# EAGLE board eTapper1main52 (EAGLE 8.6.1)
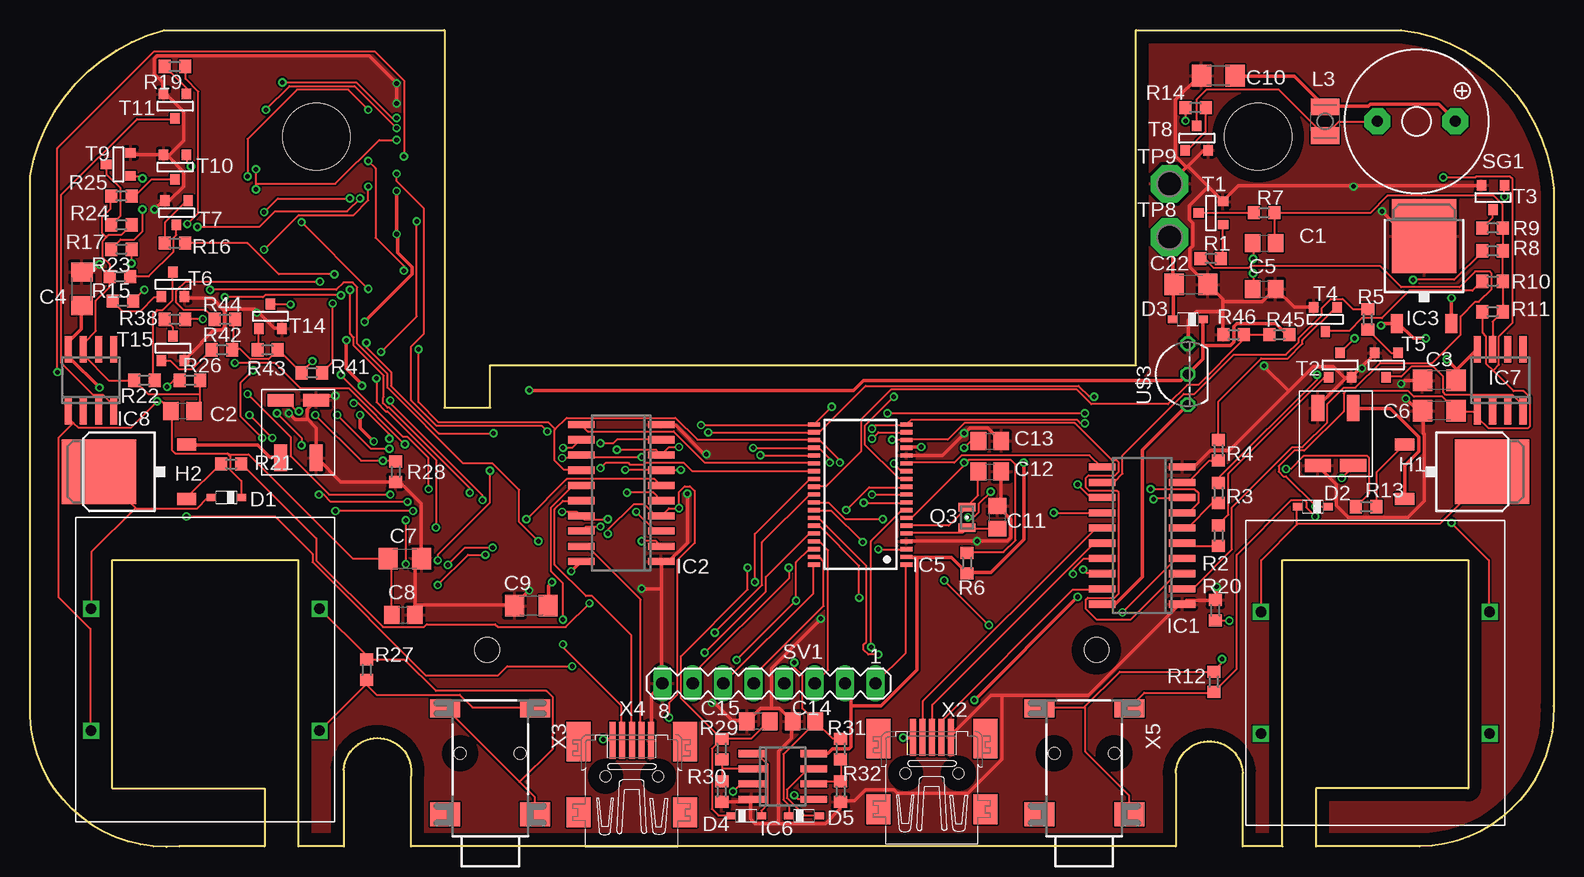
[diagram p1: board, top side]
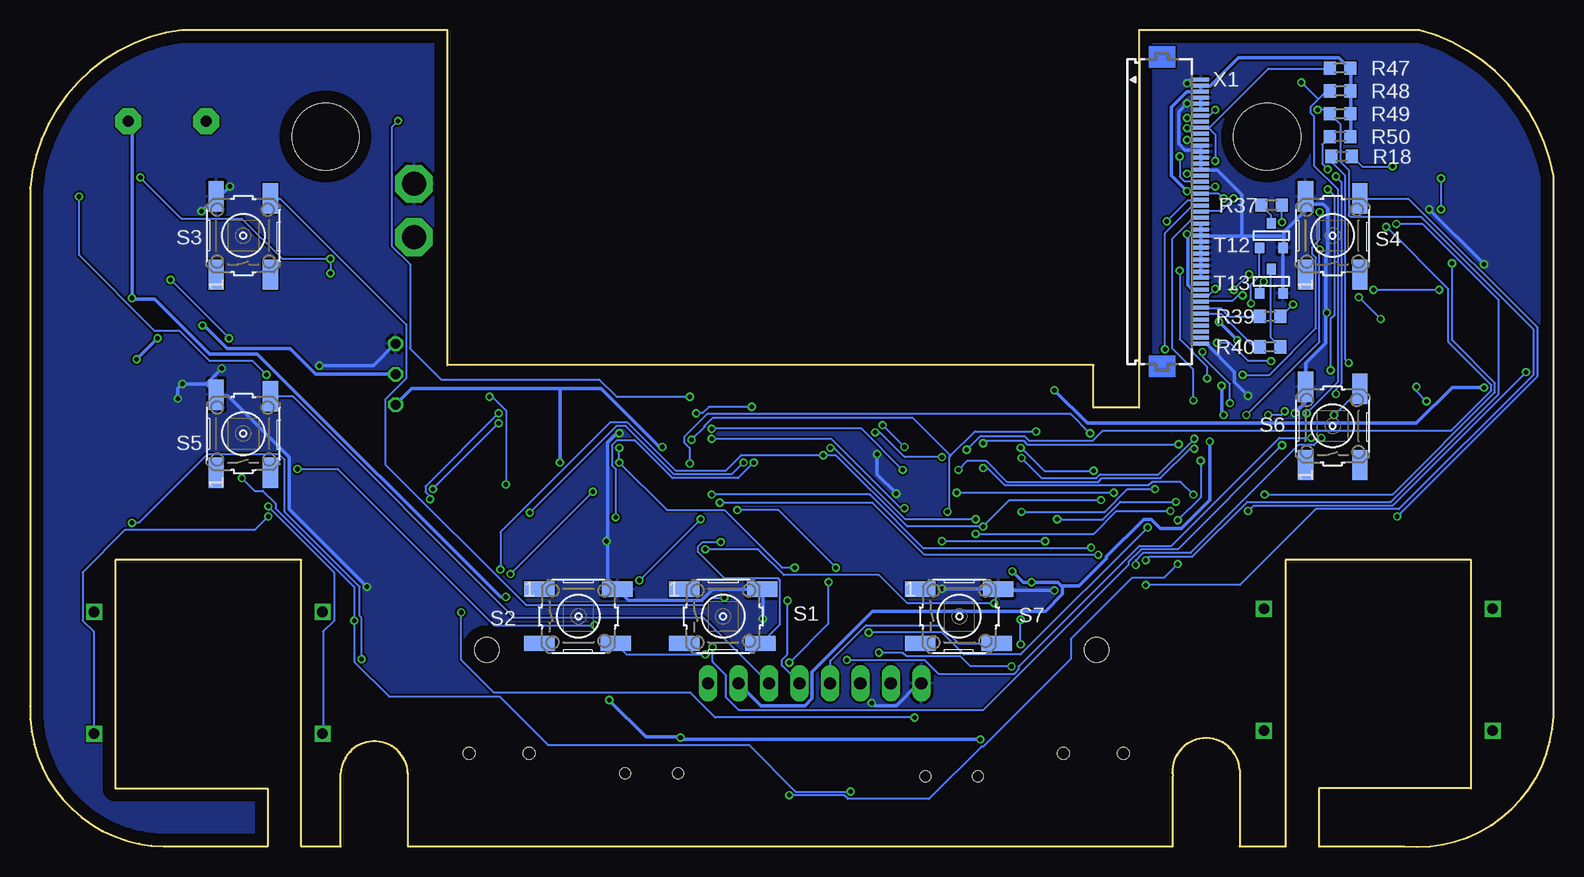
[diagram p2: board, bottom side, seen from below]

Size 127 x 68.12 mm. Coordinates in mm from the lower left corner, seen from the top.
Outline: 104.4,23.93 119.89,23.93 119.89,4.88 107.19,4.88 107.19,0.05 115.83,0.05 arc91 127,11.73 127,54.91 arc78 114.3,68.12 92.21,68.12 92.21,40.18 38.36,40.18 38.36,36.63 34.55,36.63 34.55,68.12 11.18,68.12 arc65 0,55.93 0,11.99 arc98 12.45,0.05 19.56,0.05 19.56,4.88 6.86,4.88 6.86,23.93 22.36,23.93 22.36,0.05 26.17,0.05 26.17,6.4 arc-185 31.75,5.89 31.75,0.05 95.51,0.05 95.51,6.15 arc-175 101.1,6.15 101.1,0.05 104.4,0.05 104.4,23.93
Copper layers (1*16): Top 0.035mm / dielectric 30mil / Bottom 0.035mm
Design rules "default *": minimum track width 6mil, minimum drill 15mil, track to track 6mil, track to pad 6mil, pad to pad 6mil, via to via 6mil, smd to smd 6mil, copper to edge 40mil, drill to drill 6mil, minimum pad ring 6mil, minimum via ring 6mil, stop-mask expansion 4mil, vias tented up to drill 0mil, thermal gap 10mil
Net classes: 1 GND: width 0.305 mm, clearance 0.152 mm; 2 BAT+: width 0.305 mm, clearance 0.152 mm; 3 +9V: width 0.305 mm, clearance 0.152 mm; 4 +3V: width 0.305 mm, clearance 0.152 mm; 5 VCC: width 0.305 mm, clearance 0.152 mm
Holes 5.59 mm at 23.88,59.23 102.37,59.23
Holes 2.03 mm at 38.1,16.43 88.9,16.43

## Footprints (pad centres in the part's own frame; a part is rotated, then mirrored left to right if it is on the bottom)
C0805 = smd 1.3 x 1.5: 1 -0.95,0; 2 0.95,0
C1206 = smd 1.6 x 1.8: 1 -1.4,0; 2 1.4,0
SOD323_ST = smd 0.8 x 0.6: A 1.25,0; C -1.25,0
XFMR = drill 0.889 square: P$1 -10.16,5.08; P$2 -10.16,-5.08; P$3 8.89,5.08; P$4 8.89,-5.08
D-PAK_TO252AA = smd 1 x 1.6: 1 -2.28,-4.8; 3 2.28,-4.8 | smd 5.4 x 6.2: 4 0,2.5
SO20 = smd 0.6 x 2.2: 1 -5.715,-3.33; 2 -4.445,-3.33; 3 -3.175,-3.33; 4 -1.905,-3.33; 5 -0.635,-3.33; 6 0.635,-3.33; 7 1.905,-3.33; 8 3.175,-3.33; 9 4.445,-3.33; 10 5.715,-3.33; 11 5.715,3.33; 12 4.445,3.33; 13 3.175,3.33; 14 1.905,3.33; 15 0.635,3.33; 16 -0.635,3.33; 17 -1.905,3.33; 18 -3.175,3.33; 19 -4.445,3.33; 20 -5.715,3.33
TO252 = smd 1 x 1.6: 1 -2.28,-4.8; 3 2.28,-4.8 | smd 5.4 x 6.2: 2 0,2.5
TSSOP38_R-PDSO-G38-DA = smd 0.35 x 1: 1 -5.85,-3.85; 2 -5.2,-3.85; 3 -4.55,-3.85; 4 -3.9,-3.85; 5 -3.25,-3.85; 6 -2.6,-3.85; 7 -1.95,-3.85; 8 -1.3,-3.85; 9 -0.65,-3.85; 10 0,-3.85; 11 0.65,-3.85; 12 1.3,-3.85; 13 1.95,-3.85; 14 2.6,-3.85; 15 3.25,-3.85; 16 3.9,-3.85; 17 4.55,-3.85; 18 5.2,-3.85; 19 5.85,-3.85; 20 5.85,3.85; 21 5.2,3.85; 22 4.55,3.85; 23 3.9,3.85; 24 3.25,3.85; 25 2.6,3.85; 26 1.95,3.85; 27 1.3,3.85; 28 0.65,3.85; 29 0,3.85; 30 -0.65,3.85; 31 -1.3,3.85; 32 -1.95,3.85; 33 -2.6,3.85; 34 -3.25,3.85; 35 -3.9,3.85; 36 -4.55,3.85; 37 -5.2,3.85; 38 -5.85,3.85
SO8 = smd 0.6 x 2.2: 1 -1.905,-2.6; 2 -0.635,-2.6; 3 0.635,-2.6; 4 1.905,-2.6; 5 1.905,2.6; 6 0.635,2.6; 7 -0.635,2.6; 8 -1.905,2.6
SO08 = smd 0.6 x 2.2: 1 -1.905,-2.6; 2 -0.635,-2.6; 3 0.635,-2.6; 4 1.905,-2.6; 5 1.905,2.6; 6 0.635,2.6; 7 -0.635,2.6; 8 -1.905,2.6
L2825P = smd 1.4 x 2.4: 1 -1.2,0; 2 1.2,0
FC-12M = smd 0.7 x 1.4: 1 -0.85,0; 2 0.85,0
R0603 = smd 1 x 1.1: 1 -0.85,0; 2 0.85,0
B3F-10XX = smd 2.54 x 1.27: 1 -3.251,2.261; 2 3.251,2.261; 3 -3.251,-2.261; 4 3.099,-2.261
F/QMBIII = drill 0.914 pad 2.159 octagon: + 3.251,0; - -3.251,0
MA08-1 = drill 1.016 long: 1 -8.89,0; 2 -6.35,0; 3 -3.81,0; 4 -1.27,0; 5 1.27,0; 6 3.81,0; 7 6.35,0; 8 8.89,0
SOT-23 = smd 0.787 x 0.889: 1 0.025,-1.016; 2 -0.94,1.016; 3 0.991,1.016
P1-20 = drill 2.007 pad 3.15 octagon: TP 0,0
CT02-250 = smd 1.067 x 2.184: P$1 -1.45,-2.4; P$2 1.5,-2.4 | smd 2.184 x 1.067: P$3 1.5,2.4; P$4 -1.45,2.4
TO92- = drill 0.813 octagon: 1 -1.27,1.27; 2 1.27,1.27; 3 3.81,1.27
FH12-45S-0.5SH = smd 0.3 x 1.3: 1 -13,3.25; 2 -12.5,3.25; 3 -12,3.25; 4 -11.5,3.25; 5 -11,3.25; 6 -10.5,3.25; 7 -10,3.25; 8 -9.5,3.25; 9 -9,3.25; 10 -8.5,3.25; 11 -8,3.25; 12 -7.5,3.25; 13 -7,3.25; 14 -6.5,3.25; 15 -6,3.25; 16 -5.5,3.25; 17 -5,3.25; 18 -4.5,3.25; 19 -4,3.25; 20 -3.5,3.25; 21 -3,3.25; 22 -2.5,3.25; 23 -2,3.25; 24 -1.5,3.25; 25 -1,3.25; 26 -0.5,3.25; 27 0,3.25; 28 0.5,3.25; 29 1,3.25; 30 1.5,3.25; 31 2,3.25; 32 2.5,3.25; 33 3,3.25; 34 3.5,3.25; 35 4,3.25; 36 4.5,3.25; 37 5,3.25; 38 5.5,3.25; 39 6,3.25; 40 6.5,3.25; 41 7,3.25; 42 7.5,3.25; 43 8,3.25; 44 8.5,3.25; 45 9,3.25
32005-201 = smd 3.1 x 0.5: 1 3,1.6; 2 3,0.8; 3 3,0; 4 3,-0.8; 5 3,-1.6 | smd 2.5 x 2: M1 -3,-4.45; M2 -3,4.45 | smd 3.3 x 2: M3 2.9,4.45; M4 2.9,-4.45 | hole 0.9: 0,2.2; 0,-2.2
1503_02 = smd 2.5 x 1.5: 1 -3.75,-10.75; 3 3.75,-10.75 | smd 2.5 x 2: 2 -3.75,-1.9; 2@2 3.75,-1.9 | hole 1: -2.5,-7; 2.5,-7

## Placement (x,y rotation side)
C1  .01uF  [C0805]  102.87,50.34 0 top
C2  .01uF  [C0805]  12.7,36.37 0 top
C3  [C1206]  117.48,38.91 180 top
C4  [C1206]  4.32,46.53 90 top
C5  3.3uF  [C0805]  102.87,46.53 0 top
C6  220uF  [C1206]  117.48,36.37 180 top
C7  220uF  [C1206]  31.25,24.05 0 top
C8  3.3uF  [C0805]  31.12,19.35 0 top
C9  47uF  [C1206]  41.79,20.12 180 top
C10  47uF  [C1206]  99.06,64.31 180 top
C11  12pF  [C0805]  80.65,27.48 90 top
C12  12pF  [C0805]  80.01,31.29 0 top
C13  1 uF  [C0805]  80.01,33.83 0 top
C14  0.1uF  [C0805]  64.52,10.46 180 top
C15  0.1uF  [C0805]  60.71,10.46 180 top
C22  220uF  [C1206]  96.78,46.91 0 top
D1  BAT60J  [SOD323_ST]  16.39,29.13 180 top
D2  BAT60J  [SOD323_ST]  106.94,28.37 180 top
D3  BAT60J  [SOD323_ST]  96.52,43.99 180 top
D4  BAT60J  [SOD323_ST]  59.69,2.59 0 top
D5  BAT60J  [SOD323_ST]  64.52,2.59 0 top
DRILEGEND  [DRILEGEND]  -4.57,-8.42 0 top  (outside the outline)
F1  XFMR  [XFMR]  112.78,14.53 0 top
F2  XFMR  [XFMR]  15.24,14.78 0 top
H1  IRLR024N  [D-PAK_TO252AA]  119.38,31.29 270 top
H2  IRLR024N  [D-PAK_TO252AA]  8.26,31.29 90 top
IC1  74AC373  [SO20]  92.71,25.96 90 top
IC2  74AC373  [SO20]  49.28,29.51 90 top
IC3  LM2936DT-5.0  [TO252]  116.21,48.44 0 top
IC5  MSP430F2232IDA  [TSSOP38_R-PDSO-G38-DA]  69.22,29.39 90 top
IC6  AD8620R  [SO8]  62.74,5.89 270 top
IC7  LP2951M  [SO08]  122.56,38.91 0 top
IC8  LP2951M  [SO08]  5.08,38.91 0 top
L3  470uH  [L2825P]  107.95,60.5 270 top
Q3  FC-12M  [FC-12M]  78.11,27.48 90 top
R1  47K  [R0603]  98.43,49.07 0 top
R2  47K  [R0603]  99.06,25.96 90 top
R3  47K  [R0603]  99.06,29.51 90 top
R4  47K  [R0603]  99.06,33.07 90 top
R5  47K  [R0603]  111.51,43.99 270 top
R6  47K  [R0603]  78.11,23.67 270 top
R7  1K  [R0603]  102.87,52.88 0 top
R8  3K  [R0603]  121.92,49.71 0 top
R9  6K  [R0603]  121.92,51.61 0 top
R10  12K  [R0603]  121.92,47.17 0 top
R11  3K  [R0603]  121.92,44.63 0 top
R12  51K  [R0603]  98.68,13.77 270 top
R13  1K  [R0603]  111.38,28.37 0 top
R14  1K  [R0603]  97.16,61.64 0 top
R15  47K  [R0603]  7.75,45.52 180 top
R16  47K  [R0603]  12.07,50.34 180 top
R17  47K  [R0603]  7.62,49.83 180 top
R18  47K  [R0603]  17.66,57.58 0 bottom
R19  47K  [R0603]  12.07,65.07 180 top
R20  47K  [R0603]  98.81,19.73 90 top
R21  1K  [R0603]  16.77,31.93 180 top
R22  1K  [R0603]  9.53,38.91 180 top
R23  3K  [R0603]  7.5,47.55 180 top
R24  6K  [R0603]  7.62,51.87 0 top
R25  12K  [R0603]  7.62,54.28 180 top
R26  3K  [R0603]  13.34,38.91 0 top
R27  51K  [R0603]  28.07,14.78 270 top
R28  47K  [R0603]  30.48,31.29 270 top
R29  50K  [R0603]  57.66,8.18 90 top
R30  1K  [R0603]  57.66,4.62 90 top
R31  50K  [R0603]  67.57,8.18 90 top
R32  1K  [R0603]  67.57,4.62 90 top
R37  100  [R0603]  23.5,53.52 0 bottom
R38  100  [R0603]  12.07,43.99 0 top
R39  100  [R0603]  23.63,44.25 180 bottom
R40  100  [R0603]  23.63,41.71 180 bottom
R41  47K  [R0603]  23.5,39.55 0 top
R42  47K  [R0603]  16.01,41.45 180 top
R43  47K  [R0603]  19.82,41.45 180 top
R44  47K  [R0603]  16.26,43.99 180 top
R45  47K  [R0603]  104.14,42.72 0 top
R46  10K  [R0603]  100.33,42.72 0 top
R47  47K  [R0603]  17.78,64.95 0 bottom
R48  47K  [R0603]  17.78,63.04 0 bottom
R49  47K  [R0603]  17.78,61.14 0 bottom
R50  47K  [R0603]  17.78,59.23 0 bottom
S1  [B3F-10XX]  69.22,19.23 0 bottom
S2  [B3F-10XX]  81.28,19.23 0 bottom
S3  [B3F-10XX]  109.22,50.98 90 bottom
S4  [B3F-10XX]  18.42,50.98 90 bottom
S5  [B3F-10XX]  109.22,34.47 90 bottom
S6  [B3F-10XX]  18.42,35.1 90 bottom
S7  [B3F-10XX]  49.53,19.23 0 bottom
SG1  F/QMBIII  [F/QMBIII]  115.57,60.5 0 top
SV1  100mil  [MA08-1]  61.6,13.64 180 top
T1  2N3904  [SOT-23]  98.43,52.88 270 top
T2  2N3904  [SOT-23]  109.22,40.18 180 top
T3  2N3904  [SOT-23]  121.92,54.15 0 top
T4  2N3904  [SOT-23]  107.95,43.99 0 top
T5  2N3904  [SOT-23]  113.03,40.18 0 top
T6  2N3904  [SOT-23]  11.94,46.91 180 top
T7  2N3904  [SOT-23]  12.2,52.88 0 top
T8  2N3904  [SOT-23]  97.29,59.1 180 top
T9  2N3904  [SOT-23]  7.37,56.95 270 top
T10  2N3904  [SOT-23]  12.07,56.69 0 top
T11  2N3904  [SOT-23]  12.07,61.77 0 top
T12  2N3904  [SOT-23]  23.5,50.98 180 bottom
T13  2N3904  [SOT-23]  23.5,47.17 180 bottom
T14  2N3904  [SOT-23]  20.07,44.25 180 top
T15  2N3904  [SOT-23]  11.94,41.58 180 top
TP8  TPSPAD1-20  [P1-20]  95,50.85 0 top
TP9  TPSPAD1-20  [P1-20]  95,55.29 0 top
U$1  CT02-250  [CT02-250]  108.84,34.21 180 top
U$2  CT02-250  [CT02-250]  22.36,34.85 0 top
U$3  MCP1702  [TO92-]  95.25,40.69 270 top
X1  FH12-45S-0.5SH  [FH12-45S-0.5SH]  32.64,50.98 270 bottom
X2  MINI-USB-SCHIELD-32005-201  [32005-201]  75.19,6.15 90 top
X3  1503_02  [1503_02]  38.36,0.81 180 top
X4  MINI-USB-SCHIELD-32005-201  [32005-201]  50.17,5.89 90 top
X5  1503_02  [1503_02]  87.89,0.81 180 top

## Tracks (layer width: path | path; a pad name or v marks a point on that pad's centre or on a via)
+3V  (via drill 0.38)
  Top 0.305: v74.3,33.35 73.08,33.35 IC5.16 | IC1.20 90.45,20.24 92.74,22.53 92.74,33.12 96.47,36.85 U$3.3 | v30.56,54.68 v30.56,51.1 30.64,51.03 30.64,49.58 31.86,48.36 31.86,47.75 v27.89,43.79 | v43.51,22.07 43.21,21.77 43.21,20.17 C9.1 | v45.11,22.99 45.88,23.75 IC2.20 | 73.92,24.13 76.81,24.13 78.11,22.83 R6.2 78.19,22.91 80.09,22.91 82.83,25.65 v82.83,32.05 | 73.92,24.13 73.08,24.13 IC5.2 | 68.43,11.78 68.43,13.16 SV1.2 | 68.43,11.78 68.43,8.36 68.28,8.2 66.91,8.2 66.53,7.82 65.38,7.82 IC6.8 | 73.92,24.13 73.92,14.76 70.95,11.78 68.43,11.78 | v26.37,42.26 26.37,39.9 27.67,38.61 v27.67,38.45 | v27.51,36.02 27.51,34.95 v28.66,33.81
  Bottom 0.305: v74.3,33.35 74.53,33.35 79.4,38.23 82.83,38.23 | 82.83,38.23 95.18,38.23 U$3.3 | R50.2 16.92,59.26 16.92,61.09 R49.2 16.92,61.24 16.92,62.99 R48.2 16.92,63.14 16.92,64.9 R47.2 17.07,64.97 17.91,65.81 26.29,65.81 28.66,63.45 29.27,63.45 X1.2 29.42,63.45 29.42,62.99 | v30.56,51.1 30.48,51.03 30.48,46.84 30.1,46.46 29.42,46.46 X1.36 | v30.56,54.68 31.86,55.98 31.86,61.7 30.56,62.99 29.42,62.99 | 29.42,62.99 X1.3 | v45.11,22.99 44.2,22.07 v43.51,22.07 41.3,22.07 40.92,21.69 | 40.92,21.69 40.92,21.08 42.37,19.63 56.77,19.63 61.8,14.6 61.8,12.39 62.41,11.78 66.07,11.78 67.9,13.61 SV1.2 | v26.37,42.26 v27.89,43.79 | v27.67,38.45 27.67,36.17 v27.51,36.02 | v28.66,33.81 28.66,28.93 31.02,26.57 32.77,26.57 33.53,27.33 34.14,27.33 37.27,24.2 37.27,24.05 39.55,21.77 40.85,21.77 40.92,21.69 | v82.83,32.05 82.83,38.23
+9V  (via drill 0.38)
  Top 0.305: C4.1 4.27,45.08 4.27,43.18 3.2,42.11 3.2,41.58 IC8.8 3.28,41.43 3.28,40.82 v5.8,38.3 | 118.95,39.83 118.95,38.91 C3.1 | 118.95,39.83 120.63,41.5 IC7.8 | 97.77,41.81 97.77,40.66 U$3.2 96.4,39.37 95.94,38.91 69.5,38.91 68.66,38.07 v41.61,38.07 | 97.77,41.81 97.77,43.94 D3.C | R45.2 104.78,42.72 103.87,43.64 100.59,43.64 100.36,43.41 100.36,42.11 100.06,41.81 97.77,41.81 | v112.63,43.48 112.78,43.64 IC3.1 114.08,43.64 115.3,42.42 v116.36,42.42 | v118.11,40.66 118.95,39.83
  Bottom 0.305: v112.63,43.48 112.48,43.48 110.57,41.58 105.31,41.58 103.18,39.44 96.55,39.44 U$3.2 | v116.36,42.42 v118.11,40.66 | v5.8,38.3 8.46,38.3 11.43,35.33 38.87,35.33 v41.61,38.07
/LCS  (via drill 0.38)
  Top 0.152: v70.11,16.66 70.11,25.5 72.62,28.01 73,28.01 IC5.8 | v22.64,33.5 22.64,34.11 v20.58,36.17 | v30.56,60.78 30.18,60.78 27.21,63.75 v21.04,63.75
  Bottom 0.152: v70.11,16.66 70.11,15.44 68.97,14.3 68.97,12.47 67.9,11.4 47.55,11.4 35.44,23.52 35.44,23.75 34.37,24.81 31.32,24.81 v22.64,33.5 | v20.58,36.17 17.99,38.76 17.99,54.84 19.97,56.82 19.97,60.93 20.27,61.24 20.27,61.7 19.63,62.34 | 19.63,62.34 18.98,62.99 18.67,62.99 R48.1 | v30.56,60.78 30.33,60.55 29.42,60.55 X1.8 | 19.63,62.34 v21.04,63.75
/RST  (via drill 0.38)
  Top 0.152: 78,31.94 78.19,32.13 78.19,32.21 78.26,32.28 81.77,32.28 82.15,31.9 82.15,25.58 81.16,24.59 78.11,24.59 R6.1 | 78,31.94 73.54,27.48 73.08,27.48 IC5.7 | v77.88,33.27 78.41,33.81 79.02,33.81 C13.1 | 78,31.94 v77.88,32.05 | SV1.7 55.25,14.38 63.25,22.38 v63.25,23.29
  Bottom 0.152: v77.88,33.27 v77.88,32.05 73.92,28.09 69.12,28.09 64.32,23.29 v63.25,23.29
BAT+
  Top 0.305: D3.A 95.33,44.02 95.33,46.91 C22.1 95.25,46.99 95.25,50.57 95.03,50.8 TP8.TP
GND  (via drill 0.38)
  Top 0.305: T9.2 8.54,57.73 11.13,57.73 T10.2 11.21,57.58 11.51,57.58 | 11.51,57.58 12.81,56.29 12.81,55.07 11.66,53.92 11.28,53.92 T7.2 11.13,53.92 v10.37,53.16 | 11.51,57.58 12.81,58.88 12.81,61.31 11.36,62.76 11.13,62.76 T11.2 11.05,62.91 11.05,63.75 10.37,64.44 10.37,65.73 10.6,65.96 28.27,65.96 v30.56,63.68 v30.56,62 | v5.8,48.59 5.19,47.98 4.35,47.98 C4.2 | 16.16,44.78 15.17,45.77 12.96,45.77 12.88,45.85 T6.2 | 16.16,44.78 16.24,44.7 16.24,43.33 16.01,43.1 15.32,43.1 14.33,42.11 14.33,42.04 12.88,40.59 T15.2 | 18.98,44.63 18.75,44.86 16.24,44.86 16.16,44.78 | 18.98,44.63 20.35,43.25 20.96,43.25 T14.2 | v18.9,44.55 18.98,44.63 | 52.66,21.54 52.66,13.69 SV1.8 52.66,13.54 51.82,12.7 51.82,8.96 X4.5 | 52.66,21.54 52.66,23.75 IC2.1 52.81,23.75 53.19,23.75 54.79,25.35 v54.79,29.46 | v56.39,32.74 56.24,32.74 53.8,35.18 52.66,35.18 IC2.10 | 52.66,21.54 v50.98,21.54 | 32.08,20.17 32.08,23.52 32.62,24.05 C7.2 32.62,24.13 32.62,28.62 30.87,30.38 30.56,30.38 R28.2 30.48,30.45 25.91,30.45 23.93,32.43 U$2.P$2 23.86,32.59 23.86,34.95 23.09,35.71 | 32.08,20.17 32.08,19.4 C8.2 | 32.08,20.17 40.31,20.17 C9.2 40.47,20.24 v41.61,21.39 | v25.46,37.62 24.24,37.62 23.93,37.31 U$2.P$3 23.78,37.16 23.09,36.47 23.09,35.71 | v21.57,36.17 22.1,35.63 23.02,35.63 23.09,35.71 | U$1.P$3 107.37,31.75 108.89,30.22 108.89,28.47 109.88,27.48 114.84,27.48 116.21,28.85 116.21,34.42 116.13,34.49 116.13,36.32 C6.2 115.98,36.47 115.6,36.47 v114.69,37.39 | C3.2 114.61,38.91 v114.3,38.61 | 110.95,39.98 112.09,41.12 T5.2 | 110.95,39.98 110.19,39.22 T2.2 110.04,39.14 109.73,39.14 109.66,39.06
  Top 0.305: 109.66,39.06 107.37,36.78 107.37,36.63 U$1.P$2 | IC1.10 97.01,31.67 98.38,33.04 99.98,33.04 104.93,38 | 104.93,38 106.99,40.05 108.67,40.05 109.66,39.06 | v111.03,39.9 110.95,39.98 | T4.2 105.39,45.01 103.87,46.53 C5.2 103.71,46.46 102.72,45.46 99.45,45.46 | 99.45,45.46 99.45,45.69 98.23,46.91 C22.2 98.07,46.99 96.7,48.36 96.7,49.88 96.93,50.11 96.93,52.02 96.63,52.32 96.63,53.47 98.23,55.07 | 99.45,45.46 99.45,44.63 | 99.45,44.63 99.45,42.72 R46.1 | 99.45,44.63 97.24,44.63 96.55,43.94 96.55,41.96 U$3.1 | 96.4,56.67 95.03,55.29 TP9.TP | 96.4,56.67 96.51,56.78 | 96.51,56.78 97.77,58.04 98.23,58.04 T8.2 | 96.51,56.78 98.23,55.07 | 98.23,55.07 99.45,53.85 T1.2 99.52,53.92 100.74,55.14 110.34,55.14 | 110.34,55.14 120.93,55.14 T3.2 | 96.4,56.67 95.48,57.58 95.48,62.3 97.46,64.29 97.62,64.29 C10.2 | v110.34,55.07 110.34,55.14 | v112.7,53.01 114.76,50.95 116.21,50.95 IC3.2 | 104.93,38 102.87,40.05 v102.87,40.13 | IC5.4 73.08,25.5 v78.95,25.5 81.46,25.5 81.77,25.81 81.77,27.33 80.7,28.4 C11.2 80.7,28.55 80.93,28.78 80.93,31.29 C12.2 | IC5.15 73.08,32.66 76.05,32.66 v77.88,34.49 78.34,34.95 79.86,34.95 80.93,33.88 C13.2 | 61.8,11.56 62.49,11.56 63.56,10.49 C14.2 63.48,10.34 63.48,9.04 62.41,7.97 62.41,1.95 | 61.8,11.56 60.89,11.56 59.82,10.49 C15.2 59.67,10.57 58.53,10.57 57.08,12.01 v56.85,12.01 | R30.1 57.69,3.78 59.97,3.78 60.13,3.94 IC6.4 60.05,3.71 60.05,2.34 60.43,1.95 62.41,1.95 | 62.41,1.95 66.3,1.95 67.52,3.17 67.52,3.71 R32.1 67.67,3.86 68.74,3.86 69.65,4.77 72.01,4.77 72.32,4.47 78.19,4.47 81.01,7.29 81.01,12.62 | 81.01,12.62 80.09,12.62 76.81,9.35 76.81,9.19 X2.5
  Top 0.305: 81.01,12.62 88.24,12.62 95.79,20.17 95.94,20.17 IC1.1 96.09,20.24 96.4,20.55 98.76,20.55 R20.2 98.91,20.7 v98.91,21.69 | v65.92,19.02 61.8,14.91 61.8,11.56
  Bottom 0.305: v10.37,53.16 v5.8,48.59 | X1.13 29.42,57.96 29.42,57.58 X1.14 29.42,57.43 29.42,57.12 X1.15 29.42,56.97 29.42,56.51 X1.16 29.27,56.44 28.05,56.44 25.99,54.38 25.99,50.95 | X1.12 29.42,58.42 29.42,58.11 X1.13 | X1.6 29.42,61.54 29.42,61.92 X1.5 | X1.4 29.42,62.46 29.42,62.08 X1.5 | v30.56,63.68 30.26,63.98 29.42,63.98 X1.1 | X1.5 29.49,62 v30.56,62 31.25,61.31 31.25,58.65 30.71,58.11 29.57,58.11 X1.13 | X1.34 29.42,47.52 29.42,47.9 X1.33 29.42,48.13 29.42,48.44 X1.32 29.42,48.59 29.42,48.97 X1.31 29.42,49.12 29.42,49.43 X1.30 29.42,49.58 29.42,49.96 X1.29 29.42,50.11 29.42,50.42 X1.28 29.42,50.57 29.42,50.95 X1.27 | X1.27 29.42,51.1 29.42,51.41 X1.26 29.42,51.56 29.42,51.94 X1.25 | T13.2 T12.2 22.48,50.04 22.48,50.95 | 22.48,50.95 22.48,51.26 20.73,53.01 20.73,54.23 S4.2 20.65,53.62 19.21,53.62 18.83,53.24 18.83,49.5 18.98,49.35 18.98,44.55 | 18.98,44.55 18.98,42.04 20.65,40.36 20.65,38.38 S6.2 20.73,38.23 20.73,37.01 v21.57,36.17 | 22.48,50.95 25.99,50.95 | 25.99,50.95 29.27,50.95 X1.27 | v18.9,44.55 18.98,44.55 | v56.39,32.74 56.39,31.06 v54.79,29.46 | v50.98,21.54 46.33,21.54 S7.2 46.18,21.39 v41.61,21.39 | v25.46,37.62 26.6,38.76 26.6,39.6 28.96,41.96 29.34,41.96 X1.45 | 112.32,38.61 v114.3,38.61 114.69,38.23 v114.69,37.39 | 112.32,38.61 111.49,37.77 S5.2 111.41,37.62 110.49,37.62 105.39,32.51 105.39,28.17 v98.91,21.69 | v111.03,39.9 112.32,38.61 | v110.34,55.07 111.18,54.23 S3.2 v112.7,53.01 | v102.87,40.13 98.38,40.13 96.55,41.96 U$3.1 | v77.88,34.49 78.11,34.49 78.87,33.73 78.87,25.5 | 78.87,25.5 78.87,22.38 78.11,21.61 S2.2 78.03,21.46 77.12,20.55 71.02,20.55 70.11,21.46 65.99,21.46 S1.2 65.92,21.39 v65.92,19.02
  Bottom 0.305: v78.95,25.5 78.87,25.5 | v56.85,12.01 56.62,11.78 54.79,11.78 52.96,13.61 52.73,13.61 SV1.8
  pour Top: 0,68.63 127,68.63 127,0.05 0,0.05
  pour Bottom: 0,68.63 127,68.63 127,0.05 0,0.05
IO1_0  (via drill 0.38)
  Top 0.152: v69.42,25.42 66.83,28.01 65.38,28.01 IC5.31
  Bottom 0.152: v69.42,25.42 70.95,25.42 71.33,25.04 71.33,24.59 69.12,22.38 64.62,22.38 64.47,22.22 64.47,18.57 66.07,16.97 S1.4
IO1_1  (via drill 0.38)
  Top 0.152: v70.72,16.05 69.88,16.05 69.5,16.43 69.5,16.89 69.73,17.12 69.73,23.44 65.77,27.41 65.38,27.41 IC5.32
  Bottom 0.152: v70.72,16.05 77.27,16.05 S2.4
IO1_2  (via drill 0.38)
  Top 0.152: v69.12,20.78 69.12,23.44 65.84,26.72 65.38,26.72 IC5.33
  Bottom 0.152: v69.12,20.78 70.18,20.78 70.79,20.17 85.65,20.17 97.39,31.9 97.39,37.31 95.64,39.06 95.64,43.56 106.15,54.08 S3.4
IO1_3  (via drill 0.38)
  Top 0.152: v56.24,16.2 61.35,21.31 61.35,22.53 64.93,26.11 65.31,26.11 IC5.34 | v45.19,15.06 39.78,15.06 39.02,14.3 33,14.3 23.55,23.75 23.55,24.43 20.43,27.56 v13.03,27.56
  Bottom 0.152: v56.24,16.2 54.26,16.2 53.95,15.9 49.46,15.9 48.62,15.06 v45.19,15.06 | v13.03,27.56 1.38,39.22 1.38,43.33 12.12,54.08 S4.4
IO4_0  (via drill 0.38)
  Top 0.152: IC1.3 96.02,22.76 95.56,22.76 91.75,18.95 88.93,18.95 88.02,19.86 88.02,20.62 88.17,20.78 90.38,20.78 90.76,21.16 90.76,29.54 90.61,29.69 88.32,29.69 88.02,30 88.02,30.76 88.24,30.99 90.45,30.99 90.76,31.29 90.76,32.05 90.61,32.21 90.23,32.21 87.1,35.33 77.88,35.33 76.51,33.96 73.08,33.96 IC5.17 73,33.96 v71.86,33.96 | v30.56,56.13 30.56,55.52 32.85,53.24 32.85,42.8 31.78,41.73 31.78,37.24 33.91,35.1 42.68,35.1 v43.13,34.64 | v50.53,27.94 52.13,26.34 IC2.3
  Bottom 0.152: v30.56,56.13 30.41,55.98 29.42,55.98 X1.17 | v43.13,34.64 48.24,34.64 50.26,32.62 | 50.26,32.62 50.37,32.51 50.37,28.09 v50.53,27.94 | v71.86,33.96 70.79,35.03 70.79,35.1 70.11,35.79 53.42,35.79 50.26,32.62
IO4_1  (via drill 0.38)
  Top 0.152: v70.18,34.03 70.72,34.57 73,34.57 IC5.18 | v31.17,57.58 31.17,63.91 28.73,66.34 10.37,66.34 2.29,58.27 v2.29,39.6 | v31.93,28.01 v25.46,28.01 | v48.16,26.11 48.16,26.41 50.3,28.55 51.21,28.55 52.13,27.63 52.58,27.63 IC2.4 52.66,27.63 53.27,28.24 v54.11,28.24 54.11,29.62 54.56,30.07 55.02,30.07 55.4,29.69 55.4,25.35 53.95,23.9 53.95,12.7 53.27,12.01 v53.27,10.79 | IC1.4 95.56,24.05 v91.06,19.56
  Bottom 0.152: v70.18,34.03 60.2,34.03 54.41,28.24 v54.11,28.24 | v31.17,57.58 31.17,55.9 30.79,55.52 29.42,55.52 X1.18 | v2.29,39.6 13.42,28.47 25,28.47 v25.46,28.01 | v31.93,28.01 36.43,28.01 38.33,26.11 v48.16,26.11 | v91.06,19.56 91.06,15.59 88.32,12.85 71.94,12.85 69.88,10.79 v53.27,10.79
IO4_2  (via drill 0.38)
  Top 0.152: v70.18,34.87 70.49,35.18 73,35.18 IC5.19 73.08,35.25 73.46,35.63 87.25,35.63 87.56,35.33 v87.94,35.33 | v54.26,31.44 52.66,31.44 IC2.7 52.58,31.44 v49.61,31.44 | v28.2,55.07 28.2,53.92 26.98,52.7 22.41,52.7 v19.51,49.81 | v25.61,36.02 28.43,33.2 v29.95,33.2 | IC1.7 96.55,27.86 97.39,28.7 97.39,29.54 97.08,29.84 v93.43,29.84
  Bottom 0.152: v70.18,34.87 57.69,34.87 v54.26,31.44 | v28.2,55.07 28.27,54.99 29.34,54.99 X1.19 | v19.51,49.81 19.51,42.11 v25.61,36.02 | v29.95,33.2 30.33,33.2 32.77,30.76 37.65,30.76 37.95,30.45 45.57,30.45 47.32,32.21 48.85,32.21 v49.61,31.44 | v87.94,35.33 v93.43,29.84
IO4_3  (via drill 0.38)
  Top 0.152: v55.94,35.18 65.31,35.18 IC5.20 65.38,35.25 v66.83,36.7 | v54.11,33.35 53.27,33.35 52.66,32.74 IC2.8 52.58,32.74 52.2,33.12 v48.92,33.12 | v27.51,54.08 26.45,53.01 20.43,53.01 19.13,51.71 v13.95,51.71 | v93.65,29.01 93.73,29.08 96.02,29.08 IC1.8 | v71.48,36.17 v87.94,36.17
  Bottom 0.152: v54.11,33.35 v55.94,35.18 | v27.51,54.08 27.89,54.46 29.34,54.46 X1.20 | v13.95,51.71 8.77,46.53 8.77,42.11 5.19,38.53 5.19,38.07 8.54,34.72 37.57,34.72 38.41,33.88 43.74,33.88 44.12,34.26 47.78,34.26 v48.92,33.12 | v93.65,29.01 93.65,29.23 94.04,29.62 94.04,30.07 v87.94,36.17 | v71.48,36.17 70.95,36.17 70.41,36.7 v66.83,36.7
IO4_4  (via drill 0.38)
  Top 0.152: v56.54,34.57 65.31,34.57 IC5.21 65.38,34.64 65.84,34.64 69.65,38.45 87.41,38.45 88.32,37.54 v88.7,37.54 | v50.98,32.51 46.11,32.51 45.95,32.66 IC2.13 45.88,32.66 45.65,32.43 v44.35,32.43 | v32.24,52.17 32.24,44.25 v29.27,41.27 | v26.98,37.01 27.36,37.01 29.95,34.42 v29.95,34.03 | v87.33,30.22 88.4,29.16 89.31,29.16 IC1.13
  Bottom 0.152: v56.54,34.57 56.16,34.57 54.11,32.51 v50.98,32.51 | v32.24,52.17 30.48,53.92 29.42,53.92 X1.21 | v29.27,41.27 29.27,40.89 26.98,38.61 v26.98,37.01 | v29.95,34.03 32.92,31.06 37.8,31.06 38.1,30.76 42.68,30.76 v44.35,32.43 | v87.33,30.22 87.33,36.4 88.47,37.54 v88.7,37.54
IO4_5  (via drill 0.38)
  Top 0.152: 43.78,34.83 43.74,34.8 43.74,32.21 44.51,31.44 45.88,31.44 IC2.14 | 43.78,34.83 44.73,35.79 53.8,35.79 55.63,33.96 65.31,33.96 IC5.22 65.38,33.88 65.84,33.88 67.52,32.21 v67.52,32.05 | v32.39,41.5 32.39,37.08 34.07,35.41 43.21,35.41 43.78,34.83 | v85.35,27.86 IC1.14
  Bottom 0.152: v32.39,41.5 32.39,51.18 30.1,53.47 29.42,53.47 X1.22 | v85.35,27.86 78.11,35.1 77.35,35.1 73.31,31.06 68.51,31.06 v67.52,32.05
IO4_6  (via drill 0.38)
  Top 0.152: v60.28,33.27 65.31,33.27 IC5.23 65.38,33.27 65.77,33.27 66.68,32.36 v66.68,32.05 | v48.16,27.33 46.18,27.33 45.95,27.56 IC2.17 45.88,27.63 45.57,27.94 v44.35,27.94 | v26.67,54.08 20.65,54.08 v19.51,52.93 | v25.91,39.37 31.09,34.19 31.48,34.19 33.23,32.43 v33.23,29.84 | IC1.17 87.86,24.05 86.95,23.14 v86.95,22.76 | v80.09,29.62 79.1,28.62 79.1,27.94 78.64,27.48 v78.19,27.48
  Bottom 0.152: v60.28,33.27 59.97,33.27 54.03,27.33 v48.16,27.33 | v26.67,54.08 27.74,53.01 29.34,53.01 X1.23 | v19.51,52.93 19.51,50.65 20.12,50.04 20.12,49.43 19.82,49.12 19.82,43.25 23.7,39.37 v25.91,39.37 | v33.23,29.84 35.51,29.84 37.42,27.94 v44.35,27.94 | v80.09,29.62 v86.95,22.76 | v78.19,27.48 78.19,31.52 78.49,31.82 78.49,33.5 78.11,33.88 76.59,33.88 73.46,30.76 67.97,30.76 v66.68,32.05
IO4_7  (via drill 0.38)
  Top 0.152: v60.89,32.66 65.31,32.66 IC5.24 | v47.55,26.72 46.33,26.72 IC2.18 | v30.03,37.24 30.03,37.01 37.72,29.31 v37.72,28.93 | v87.79,23.14 88.09,22.83 89.31,22.83 IC1.18
  Bottom 0.152: v30.03,37.24 30.03,39.83 31.78,41.58 31.78,50.72 30.03,52.48 29.42,52.48 X1.24 | v37.72,28.93 45.34,28.93 v47.55,26.72 53.88,26.72 59.82,32.66 v60.89,32.66 67.75,32.66 69.04,31.37 73.16,31.37 77.2,35.41 78.64,35.41 87.79,26.26 v87.79,23.14
LADC  (via drill 0.38)
  Top 0.152: D4.C 58.37,2.64 57.38,2.64 56.85,3.17 56.85,8.2 57.61,8.96 R29.2 | v68.05,28.09 69.96,30 73,30 IC5.11 | v59.82,23.29 59.82,21.46 54.26,15.9 54.26,12.39 57.61,9.04 R29.2 | C15.1 61.65,10.41 61.5,10.41 60.13,9.04 57.69,9.04 R29.2
  Bottom 0.152: v68.05,28.09 64.62,28.09 v59.82,23.29
LCLOCK
  Top 0.152: IC1.16 89.31,25.27 88.63,25.27 75.21,11.86 75.21,9.19 X2.3
LCLR
  Top 0.152: IC1.19 89.31,21.46 86.95,21.46 76.05,10.57 76.05,9.19 X2.4
LD_/C  (via drill 0.38)
  Top 0.152: IC5.29 65,29.39 61.04,25.42 61.04,21.84 v57.08,17.88 | v33.84,26.64 33.84,32.28 29.8,36.32 29.65,36.32 28.88,37.08 v28.88,39.06 | v31.17,48.06 31.17,48.44 28.81,50.8 28.81,56.59 v28.2,57.2
  Bottom 0.152: v57.08,17.88 50.98,17.88 49.15,16.05 44.43,16.05 v33.84,26.64 | v28.88,39.06 28.88,40.05 31.17,42.34 v31.17,48.06 | v28.2,57.2 28.2,59.41 28.73,59.94 | 28.73,59.94 29.34,59.94 X1.9 | 28.73,59.94 23.78,64.9 18.67,64.9 R47.1
LDIN
  Top 0.152: IC1.15 89.31,26.57 88.85,26.57 74.45,12.17 74.45,9.19 X2.2
LEDK1  (via drill 0.38)
  Top 0.152: v28.2,46.53 v22.64,52.09
  Bottom 0.152: v22.64,52.09 22.64,53.47 R37.2 | v28.2,46.53 28.73,46 29.34,46 X1.37
LEDK2  (via drill 0.38)
  Top 0.152: v14.41,44.02 12.96,44.02 R38.2 | v16.24,45.85 19.44,45.85 19.59,46 v25.91,46
  Bottom 0.152: v16.24,45.85 v14.41,44.02 | v25.91,46 26.29,46 26.75,45.54 29.34,45.54 X1.38
LEDK3
  Bottom 0.152: R39.2 27.06,44.25 27.74,44.93 29.34,44.93 X1.39
LEDK4
  Bottom 0.152: R40.2 24.54,41.73 25,41.73 27.74,44.47 29.34,44.47 X1.40
LHVTRIG  (via drill 0.38)
  Top 0.152: v71.1,27.33 67.97,27.33 66.6,28.7 65.38,28.7 IC5.30 | v79.94,18.49 v76.2,22.22 | v104.7,31.52 105.08,31.52 106.15,32.59 111.49,32.59 111.64,32.43 111.64,29.46 110.57,28.4 R13.1
  Bottom 0.152: v76.2,22.22 v71.1,27.33 | v79.94,18.49 88.32,18.49 101.35,31.52 v104.7,31.52
LLED  (via drill 0.38)
  Top 0.152: R44.1 17.07,43.94 16.92,43.79 16.92,41.5 R42.1 17,41.5 17.53,41.5 18.37,40.66 19.89,40.66 20.65,41.43 R43.1 20.73,41.43 22.56,39.6 R41.1 22.64,39.6 v23.55,40.51 | v72.01,31.98 72.62,31.37 73,31.37 IC5.13 | v38.64,34.49 34.07,34.49 30.1,38.45 30.1,39.6 28.05,41.65 v28.05,42.04
  Bottom 0.152: v72.01,31.98 72.01,33.27 72.47,33.73 72.47,34.19 70.57,36.09 40.24,36.09 v38.64,34.49 | v28.05,42.04 26.98,42.04 25.46,40.51 v23.55,40.51
LOPA  (via drill 0.38)
  Top 0.152: v99.98,18.87 98.84,18.87 R20.1 | v109.35,30.76 110.34,31.75 U$1.P$4 | v58.6,4.62 59.21,5.23 60.13,5.23 IC6.3
  Bottom 0.152: v109.35,30.76 108.28,29.69 107.6,29.69 106.53,28.62 106.53,28.24 99.98,21.69 v99.98,18.87 99.98,15.44 97.08,12.55 87.86,12.55 83.82,8.51 67.06,8.51 63.17,4.62 v58.6,4.62
LRD  (via drill 0.38)
  Top 0.152: v70.18,29.39 IC5.10 | v38.56,24.97 36.28,24.97 v34.83,23.52 | v19.36,34.11 17.53,35.94 17.53,38.68 v18.6,39.75 | v18.83,56.51 18.83,55.29 | 18.83,55.29 v18.83,54.84 | v30.56,58.95 29.11,58.95 25.46,55.29 18.83,55.29
  Bottom 0.152: v70.18,29.39 57,29.39 52.51,24.89 38.64,24.89 v38.56,24.97 | v34.83,23.52 34.83,23.9 34.22,24.51 30.26,24.51 21.26,33.5 19.97,33.5 v19.36,34.11 | v18.6,39.75 18.6,44.02 18.29,44.32 18.29,54.3 v18.83,54.84 | v18.83,56.51 19.28,56.97 19.28,58.57 18.67,59.18 R50.1 | v30.56,58.95 29.42,58.95 X1.11
LRESET  (via drill 0.38)
  Top 0.152: v47.55,31.6 48.01,32.05 49.84,32.05 49.99,31.9 51.21,31.9 51.36,32.05 54.49,32.05 55.17,31.37 65.31,31.37 IC5.26 | v30.03,29.39 24.92,29.39 21.72,32.59 21.72,34.19 v18.14,37.77 | v18.14,55.9 18.14,59.03 22.25,63.14 26.52,63.14 v28.2,61.47
  Bottom 0.152: v47.55,31.6 47.17,31.6 45.72,30.15 33.76,30.15 33.46,30.45 31.09,30.45 v30.03,29.39 | v18.14,37.77 18.14,38.15 17.68,38.61 17.68,55.45 v18.14,55.9 | v28.2,61.47 28.66,61.01 29.34,61.01 X1.7
LTS+  (via drill 0.38)
  Top 0.152: X5.1 91.67,11.63 92.89,12.85 98.68,12.85 R12.2 100.59,14.83 100.59,24.36 105.16,28.93 106.23,28.93 106.38,28.78 106.38,28.32 v107.14,27.56
  Bottom 0.152: v107.14,27.56 108.28,26.41 119.11,26.41 122.61,22.91 122.61,18.87 121.7,17.96 121.7,9.5 F1.P$4
LTS-  (via drill 0.38)
  Top 0.152: 87.9,11.67 87.86,11.63 84.21,11.63 X5.3 | 87.9,11.67 90.83,14.6 98.68,14.6 R12.1 98.68,14.68 99.37,15.37 v99.37,15.67 | X5.2 91.6,2.72 91.6,4.32 87.94,7.97 87.94,11.63 87.9,11.67 | v118.5,27.02 121.62,23.9 121.62,19.63 F1.P$3
  Bottom 0.152: v118.5,27.02 117.96,27.02 112.25,32.74 106.23,32.74 105.77,32.28 105.77,27.94 99.52,21.69 99.52,19.25 99.37,19.1 v99.37,15.67
LVSEL
  Top 0.152: IC5.14 73.08,32.05 77.04,32.05 77.65,32.66 88.32,32.66 89.31,31.67 IC1.11
LWR  (via drill 0.38)
  Top 0.152: v69.5,28.7 73,28.7 IC5.9 | v37.95,24.36 36.5,24.36 v33.99,21.84 | v30.56,59.94 27.06,63.45 21.65,63.45 v19.66,61.47
  Bottom 0.152: v69.5,28.7 56.77,28.7 52.43,24.36 v37.95,24.36 | v33.99,21.84 26.14,21.84 19.82,28.17 12.88,28.17 1.68,39.37 1.68,43.18 11.05,52.55 16.92,52.55 17.07,52.7 17.07,56.44 17.76,57.12 17.76,60.25 18.6,61.09 R49.1 18.67,61.16 18.98,61.47 v19.66,61.47 | v30.56,59.94 30.1,59.49 29.42,59.49 X1.10
N$1
  Top 0.152: R1.1 97.62,49.05 97.92,49.05 98.68,48.28 101.58,48.28 101.73,48.44 112.55,48.44 114.3,46.68 119.18,46.68 120.48,47.98 121.7,47.98 121.85,47.83 121.85,46.53 120.78,45.46 120.48,45.46 119.26,44.25 119.26,42.72 116.9,40.36 112.55,40.36 110.49,38.3 109.5,38.3 108.13,36.93 108.13,35.41 106.07,33.35 105.24,33.35 100.21,28.32 100.21,24.81 96.93,21.54 96.09,21.54 IC1.2
N$2
  Top 0.152: R2.1 96.25,25.12 96.09,25.27 IC1.5
N$3
  Top 0.152: R3.1 99.06,28.62 98.53,28.62 96.55,26.64 96.09,26.64 IC1.6
N$4
  Top 0.152: R4.1 99.06,32.21 98.3,32.21 96.55,30.45 96.09,30.45 IC1.9
N$5
  Top 0.152: R5.1 111.49,44.86 110.27,44.86 109.43,45.69 108.44,45.69 107.68,44.93 107.68,44.32 105.77,42.42 105.77,42.11 104.7,41.05 100.36,41.05 97.08,37.77 96.17,37.77 91.06,32.66 91.06,31.14 90.38,30.45 89.39,30.45 IC1.12
N$6
  Top 0.152: T8.1 97.24,60.17 97.24,62.3 98.07,63.14 104.09,63.14 107.9,59.33 L3.2 107.98,59.33 109.12,60.48 112.32,60.48 SG1.-
N$7
  Top 0.152: R4.2 99.06,37.16 102.65,40.74 104.86,40.74 106.07,41.96 106.07,42.26 107.52,43.71 107.6,43.71 108.89,45.01 T4.3
N$8
  Top 0.152: T5.3 113.47,41.2 111.56,43.1 R5.2
N$9
  Top 0.152: 105.62,26.95 105.62,26.87 102.65,23.9 102.65,19.63 F1.P$1 | 105.62,26.95 105.62,28.32 D2.A | 105.62,26.95 117.5,26.95 121.85,31.29 H1.4
N$10
  Top 0.152: T1.1 101.96,52.86 R7.1
N$11  (via drill 0.38)
  Top 0.152: v110.42,42.42 T2.1 | v115.3,47.29 118.72,47.29 121.09,49.66 R8.1
  Bottom 0.152: v115.3,47.29 v110.42,42.42
N$12
  Top 0.152: T3.1 121.92,53.08 121.92,52.48 121.09,51.64 R9.1
N$13
  Top 0.152: T1.3 99.45,49.27 99.29,49.12 R1.2
N$14
  Top 0.152: T2.3 108.21,39.14 107.9,39.14 99.9,31.14 99.9,27.71 99.06,26.87 R2.2
N$15  (via drill 0.38)
  Top 0.152: v122.92,54.23 T3.3 | v107.29,39.37 107.29,38.99 99.06,30.76 R3.2
  Bottom 0.152: v122.92,54.23 122.92,49.35 116.59,43.03 114.53,43.03 112.02,40.51 108.44,40.51 v107.29,39.37
N$16
  Top 0.152: T4.1 107.98,43.03 109.96,43.03 111.03,44.09 112.7,44.09 114.99,46.38 120.25,46.38 121.01,47.14 R10.1
N$17
  Top 0.152: C1.2 103.79,50.34 103.79,52.86 R7.2 103.87,52.86 111.71,52.86 113.16,54.3 122,54.3 122.76,53.54 122.76,51.64 R9.2 122.76,51.56 122.76,49.73 R8.2 122.76,49.66 122.76,47.22 R10.2 122.76,47.14 122.76,44.63 | IC7.7 121.92,43.79 122.76,44.63 | 122.76,44.63 R11.2
N$18  (via drill 0.38)
  Top 0.152: v101.96,47.83 101.96,46.53 C5.1 | v101.96,49.05 101.96,50.34 C1.1 | 121.96,39.71 123.68,38 124.52,38 125.05,37.46 125.05,35.1 124.9,34.95 121.54,34.95 120.71,35.79 120.71,36.24 IC7.1 120.63,36.32 118.95,36.32 C6.1 118.88,36.4 117.73,37.54 115.37,37.54 114.91,38 109.66,38 109.5,37.84 109.5,36.32 106.23,33.04 105.39,33.04 104.09,31.75 104.09,31.29 104.47,30.91 104.7,30.91 107.18,28.43 | 121.96,39.71 121.39,40.28 121.39,42.57 121.09,42.87 121.09,44.63 R11.1 | v117.81,55.83 120.48,55.83 120.55,55.9 123.37,55.9 123.6,55.68 123.6,43.71 122.46,42.57 122.46,40.21 121.96,39.71 | 107.18,28.43 107.22,28.4 108.13,28.4 D2.C | v107.14,28.4 107.18,28.43
  Bottom 0.152: v101.96,47.83 v101.96,49.05 106,49.05 109.35,52.4 114.38,52.4 v117.81,55.83 | v107.14,28.4 101.66,22.91 101.66,18.87 102.57,17.96 102.57,9.5 F1.P$2
N$19
  Top 0.152: 8.81,28.28 5.8,31.29 H2.4 | 8.81,28.28 8.84,28.24 13.95,28.24 14.79,29.08 15.09,29.08 D1.A | 8.81,28.28 5.11,24.59 5.11,19.86 F2.P$1
N$20  (via drill 0.38)
  Top 0.152: v9.53,46.46 8.62,45.54 R15.1 | v15.02,46.46 25.53,46.46 26.14,47.06 26.9,47.06 27.28,46.68 27.28,41.96 29.8,39.44 29.8,38.3 36.12,31.98 38.56,31.98 40.77,29.77 40.77,27.1 v42.37,25.5 | v50.98,25.5 52.2,25.5 52.58,25.12 IC2.2
  Bottom 0.152: v15.02,46.46 v9.53,46.46 | v50.98,25.5 v42.37,25.5
N$21
  Top 0.152: R13.2 112.25,28.4 112.25,31.22 114.53,33.5 H1.1
N$22
  Top 0.152: T8.3 96.32,58.11 96.47,58.11 98,59.64 98,61.62 R14.2
N$23
  Top 0.305: H1.3 114.61,29.08 114.61,31.82 115.75,32.97 115.75,34.19 113.39,36.55 110.34,36.55 U$1.P$1
N$24  (via drill 0.38)
  Top 0.152: R16.1 18.14,50.34 20.73,47.75 v25.38,47.75 | v26.67,46.46 26.67,42.8 26.98,42.49 26.98,41.81 29.49,39.29 29.49,37.54 29.42,37.46 29.42,37.01 29.8,36.63 29.95,36.63 36.66,29.92 v36.66,29.54 | v49.76,29.54 51.97,29.54 52.58,28.93 IC2.5
  Bottom 0.152: v26.67,46.46 v25.38,47.75 | v49.76,29.54 v36.66,29.54
N$25  (via drill 0.38)
  Top 0.152: v8.46,48.67 8.46,49.81 R17.1 | v24.08,29.39 24.46,29.39 25.07,28.78 v31.48,28.78 | v41.38,27.33 44.73,30.68 52.05,30.68 52.58,30.15 IC2.6
  Bottom 0.152: v8.46,48.67 8.46,42.26 4.88,38.68 4.88,37.92 13.42,29.39 v24.08,29.39 | v31.48,28.78 36.12,28.78 37.57,27.33 v41.38,27.33
N$26  (via drill 0.38)
  Top 0.152: v17.07,40.36 20.43,40.36 22.56,38.23 26.6,38.23 v31.25,33.58 | v47.55,33.65 48.62,33.65 48.92,33.96 IC2.9
  Bottom 0.152: v17.07,40.36 17.38,40.66 17.38,55.98 18.44,57.05 18.44,57.58 R18.1 | v31.25,33.58 43.9,33.58 44.2,33.88 47.32,33.88 v47.55,33.65
N$27  (via drill 0.38)
  Top 0.152: v13.11,51.94 14.03,52.86 14.03,62.99 12.96,64.06 12.96,65.05 R19.1 | v33.99,23.9 33.99,24.36 38.33,28.7 v38.33,31.37 | v44.43,33.27 45.19,33.27 45.88,33.96 IC2.12
  Bottom 0.152: v13.11,51.94 10.9,51.94 4.58,45.62 4.58,37.77 13.57,28.78 25.53,28.78 30.1,24.2 33.68,24.2 v33.99,23.9 | v38.33,31.37 42.45,31.37 44.35,33.27 v44.43,33.27
N$28  (via drill 0.38)
  Top 0.152: v24.16,47.14 12.96,47.14 12.2,46.38 12.2,45.39 12.81,44.78 14.63,44.78 15.4,44.02 R44.2
  Bottom 0.152: v24.16,47.14 24.46,46.84 24.46,46.15 T13.3
N$29
  Top 0.152: T6.3 10.9,45.85 10.37,45.85 9.22,44.7 7.7,44.7 6.94,45.46 R15.2
N$30
  Top 0.152: T7.3 13.19,53.85 13.03,53.85 11.28,52.09 11.28,50.34 R16.2
N$31  (via drill 0.38)
  Top 0.152: v9.38,55.75 9.22,55.9 8.39,55.9 T9.3 | v9.38,53.16 9.38,51.33 8.69,50.65 7.55,50.65 6.79,49.88 R17.2
  Bottom 0.152: v9.38,53.16 v9.38,55.75
N$32  (via drill 0.38)
  Top 0.152: v13.42,56.74 13.11,57.05 13.11,57.66 T10.3
  Bottom 0.152: v13.42,56.74 15.93,56.74 16.77,57.58 R18.2
N$33
  Top 0.152: T11.3 13.03,62.84 13.03,63.3 11.28,65.05 R19.2
N$34
  Top 0.152: D4.A 60.96,2.64 60.96,3.02 61.5,3.55 61.5,6.91 60.66,7.75 60.2,7.75 IC6.1
N$35
  Top 0.152: T6.1 11.89,47.9 11.89,45.62 11.05,44.78 10.6,44.78 10.29,44.47 10.29,38.99 10.37,38.91 R22.1
N$36
  Top 0.152: T7.1 12.2,51.87 12.2,51.03 11.97,50.8 11.97,49.66 9.91,47.6 8.39,47.6 R23.1
N$37
  Top 0.152: T9.1 6.41,56.89 6.41,56.06 7.55,54.91 7.55,52.63 6.79,51.87 R24.1
N$38
  Top 0.152: T10.1 10.14,55.68 8.77,54.3 8.54,54.3 R25.1
N$39
  Top 0.152: 6.37,50.84 6.56,51.03 7.62,51.03 8.46,51.87 R24.2 | 6.37,50.84 6.02,50.49 6.02,49.2 6.63,48.59 6.63,47.6 R23.2 6.63,47.52 6.63,46.68 5.49,45.54 5.49,43.03 4.5,42.04 4.5,41.58 IC8.7 4.5,41.5 4.5,40.97 6.56,38.91 R22.2 9.83,37.77 14.18,37.77 | 6.37,50.84 6.02,51.18 6.02,52.55 6.71,53.24 6.71,54.23 R25.2 | 14.18,37.77 14.18,36.85 13.72,36.4 C2.2 | 14.18,37.77 14.18,38.91 R26.2
N$40  (via drill 0.38)
  Top 0.152: C8.1 30.1,19.4 30.1,23.82 29.87,24.05 C7.1 26.9,24.05 18.22,32.74 16.62,32.74 16.58,32.7 | 16.58,32.7 16.46,32.82 12.12,32.82 11.82,33.12 11.82,36.32 C2.1 11.74,36.4 10.98,37.16 v10.6,37.16 8.39,34.95 4.04,34.95 3.62,35.37 | 16.58,32.7 16.69,32.59 16.69,31.44 17.61,30.53 17.61,29.16 D1.C | R26.1 11.97,38.91 v11.43,38.38 | 3.62,35.37 3.2,35.79 3.2,36.24 IC8.1 | 3.62,35.37 2.37,34.11 2.37,20.85 5.03,18.19 5.03,9.73 F2.P$2
  Bottom 0.152: v11.43,38.38 11.43,38 v10.6,37.16
N$41
  Bottom 0.152: T12.1 23.55,52.02 23.55,52.7 24.31,53.47 R37.1
N$42
  Top 0.152: R21.2 15.85,31.9 13.03,29.08 H2.1
N$43
  Top 0.152: T15.1 11.89,42.65 11.89,43.33 11.28,43.94 R38.1
N$44  (via drill 0.38)
  Top 0.152: v21.72,45.24 20.05,45.24 T14.1
  Bottom 0.152: v21.72,45.24 22.71,44.25 R39.1
N$45
  Top 0.152: T5.1 113.09,39.22 114.3,39.22 115.14,40.05 116.97,40.05 117.81,39.22 117.81,37.92 118.04,37.69 123.6,37.69 124.44,36.85 124.44,36.32 IC7.4
N$46
  Bottom 0.152: T13.1 23.55,48.13 23.55,42.49 22.79,41.73 R40.1
N$47
  Top 0.152: T11.1 12.04,60.7 8.92,60.7 2.6,54.38 2.6,40.36 5.26,37.69 6.1,37.69 6.94,36.85 6.94,36.32 IC8.4
N$48
  Top 0.152: T14.3 19.05,43.18 19.05,41.58 18.98,41.5 R43.2
N$49  (via drill 0.38)
  Top 0.152: v25.23,45.31 25.23,40.44 24.39,39.6 R41.2
  Bottom 0.152: v25.23,45.31 25.23,46.91 24.54,47.6 24.54,49.96 T12.3
N$50
  Top 0.152: T15.3 10.98,40.51 11.74,40.51 12.43,39.83 13.49,39.83 15.09,41.43 R42.2
N$51
  Top 0.305: H2.3 13.11,33.5 18.98,33.5 19.97,32.51 20.88,32.51 U$2.P$1
N$52
  Top 0.152: R31.1 67.59,7.29 67.59,5.54 R32.2 67.52,5.46 65.54,5.46 65.38,5.31 IC6.6
N$54
  Top 0.152: 57.69,6.53 57.69,7.29 R29.1 | 57.69,6.53 57.69,5.54 R30.2 | IC6.2 57.69,6.53
N$55
  Top 0.152: IC6.7 64.85,6.53 63.1,4.77 63.1,4.09 64.55,2.64 65.77,2.64 D5.A
RADC  (via drill 0.38)
  Top 0.152: D5.C 63.25,2.64 63.25,3.48 62.79,3.94 62.79,7.75 65.46,10.41 C14.1 | v60.43,22.07 60.43,26.11 65,30.68 65.31,30.68 IC5.27 | v63.71,15.37 63.71,14.98 64.39,14.3 64.39,11.56 65.46,10.49 C14.1 | R31.2 67.52,9.04 66.91,9.04 65.54,10.41 C14.1
  Bottom 0.152: v60.43,22.07 60.43,18.64 v63.71,15.37
RCLOCK
  Top 0.152: IC2.16 45.88,28.85 44.43,28.85 43.74,28.17 43.74,23.52 46.33,20.93 46.87,20.93 50.14,17.65 50.14,8.96 X4.3
RCLR
  Top 0.152: IC2.19 45.95,25.04 46.49,25.04 50.91,20.62 50.91,8.96 X4.4
RDIN  (via drill 0.38)
  Top 0.152: IC2.15 45.27,30.15 43.44,28.32 43.44,22.99 44.43,22 v44.43,18.95 | v44.43,16.89 44.43,16.66 49.31,11.78 49.31,8.96 X4.2
  Bottom 0.152: v44.43,16.89 v44.43,18.95
RHVTRIG  (via drill 0.38)
  Top 0.152: v70.72,24.81 73,24.81 IC5.3 | v46.64,20.32 44.66,18.34 39.02,18.34 38.79,18.57 33.08,18.57 32.85,18.34 29.42,18.34 23.86,23.9 23.86,25.73 17.68,31.9 R21.1
  Bottom 0.152: v70.72,24.81 66.3,24.81 64.16,22.68 56.24,22.68 53.88,20.32 v46.64,20.32
ROPA  (via drill 0.38)
  Top 0.152: v23.78,36.02 27.59,32.21 v29.42,32.21 30.48,32.21 R28.1 | v22.41,36.32 22.25,36.32 21.34,37.24 20.96,37.24 U$2.P$4 | v63.71,4.32 64.01,4.01 65.31,4.01 IC6.5 | v31.32,27.25 v31.32,23.6
  Bottom 0.152: v23.78,36.02 22.71,36.02 v22.41,36.32 | v63.71,4.32 59.14,4.32 58.83,4.01 52.05,4.01 47.71,8.36 47.55,8.36 40.24,15.67 40.24,17.35 35.13,22.45 32.47,22.45 v31.32,23.6 | v31.32,27.25 29.42,29.16 v29.42,32.21
RTS+
  Top 0.152: F2.P$4 28.05,13.61 28.05,13.92 R27.2 28.05,13.54 28.88,12.7 35.82,12.7 36.89,11.63 42.07,11.63 X3.1
RTS-
  Top 0.152: F2.P$3 24.16,19.86 28.05,15.98 28.05,15.67 R27.1 28.12,15.59 31.25,15.59 33.84,13 43.06,13 43.59,12.47 43.59,8.2 40.81,5.42 | 40.81,5.42 34.68,11.56 X3.3 | 40.81,5.42 42.07,4.16 42.07,2.72 X3.2
RVSEL
  Top 0.152: IC5.25 65.31,32.05 56.24,32.05 53.65,34.64 46.49,34.64 45.95,35.18 IC2.11
SPKR  (via drill 0.38)
  Top 0.152: v72.01,37.54 69.58,35.1 69.58,33.58 72.39,30.76 73,30.76 IC5.12 | v96.32,60.55 96.32,61.62 R14.1
  Bottom 0.152: v72.01,37.54 78.11,37.54 79.56,38.99 92.74,38.99 95.33,41.58 95.33,48.59 96.85,50.11 96.85,60.02 v96.32,60.55
TCK
  Top 0.152: SV1.3 66.53,14.76 66.53,24.74 65.84,25.42 65.38,25.42 IC5.35
  Bottom 0.152: SV1.3 70.87,19.1 86.64,19.1 105.08,37.54 106.91,37.54 S5.4
TDI
  Top 0.152: IC5.37 65.38,24.13 65.84,24.13 66.15,23.82 66.15,20.09 60.35,14.3 60.35,13.69 SV1.5
  Bottom 0.152: S7.4 49.61,16.97 51.13,18.49 57.31,18.49 60.28,15.52 60.28,13.69 SV1.5
TDO
  Top 0.152: SV1.6 65.31,21.16 65.31,23.52 IC5.38
TEST
  Top 0.152: IC5.1 73,23.52 73,16.2 70.49,13.69 SV1.1
TMS  (via drill 0.38)
  Top 0.152: IC5.36 65.31,24.81 64.93,24.81 63.86,23.75 v63.86,20.55 v58.91,15.59 | v20.2,34.11 v18.29,36.02
  Bottom 0.152: v63.86,20.55 63.86,16.05 64.32,15.59 64.32,15.14 62.87,13.69 SV1.4 | v18.29,36.02 16.16,38.15 S6.4 | v20.2,34.11 22.86,34.11 31.86,25.12 34.52,25.12 44.58,15.06 44.58,14.83 44.96,14.45 51.29,14.45 52.43,15.59 v58.91,15.59
VBAT
  Top 0.152: IC5.28 65.38,30.07 66.37,30.07 69.27,32.97 69.27,35.63 71.78,38.15 87.25,38.15 88.47,36.93 94.87,36.93 96.47,38.53 97.39,38.53 101.12,42.26 101.12,42.72 R46.2 R45.1
VCC  (via drill 0.38)
  Top 0.305: v47.78,8.96 48.54,8.96 X4.1 | v72.78,9.12 73.54,9.12 X2.1 | C10.1 100.51,64.29 105.39,64.29 107.9,61.77 L3.1 108.06,61.77 111.56,61.77 111.71,61.92 117.43,61.92 118.8,60.55 SG1.+ | v118.5,45.77 118.5,43.71 IC3.3 | v87.33,20.85 v78.72,12.24
  Bottom 0.305: v47.78,8.96 72.62,8.96 v72.78,9.12 72.85,9.19 75.67,9.19 v78.72,12.24 | SG1.+ 118.5,60.17 v118.5,45.77 118.42,45.69 116.59,45.69 112.02,41.12 108.06,41.12 87.79,20.85 v87.33,20.85
XIN
  Top 0.152: IC5.6 73.08,26.8 76.59,26.8 Q3.2 78.11,28.4 79.02,29.31 79.02,31.29 C12.1
XOUT
  Top 0.152: 78.11,26.57 77.73,26.19 73.08,26.19 IC5.5 | 78.11,26.57 80.62,26.57 C11.1 | 78.11,26.57 Q3.1

## Text on the board
tDocu: eTapper Main R52
DrillLegend: LAYER-STACK
DrillLegend_01-16: 01-16
DrillLegend_01-20: 01-20